# Altium schematic sheet circuit.SchDoc
size A4; SheetNumber: 1; SheetTotal: 2
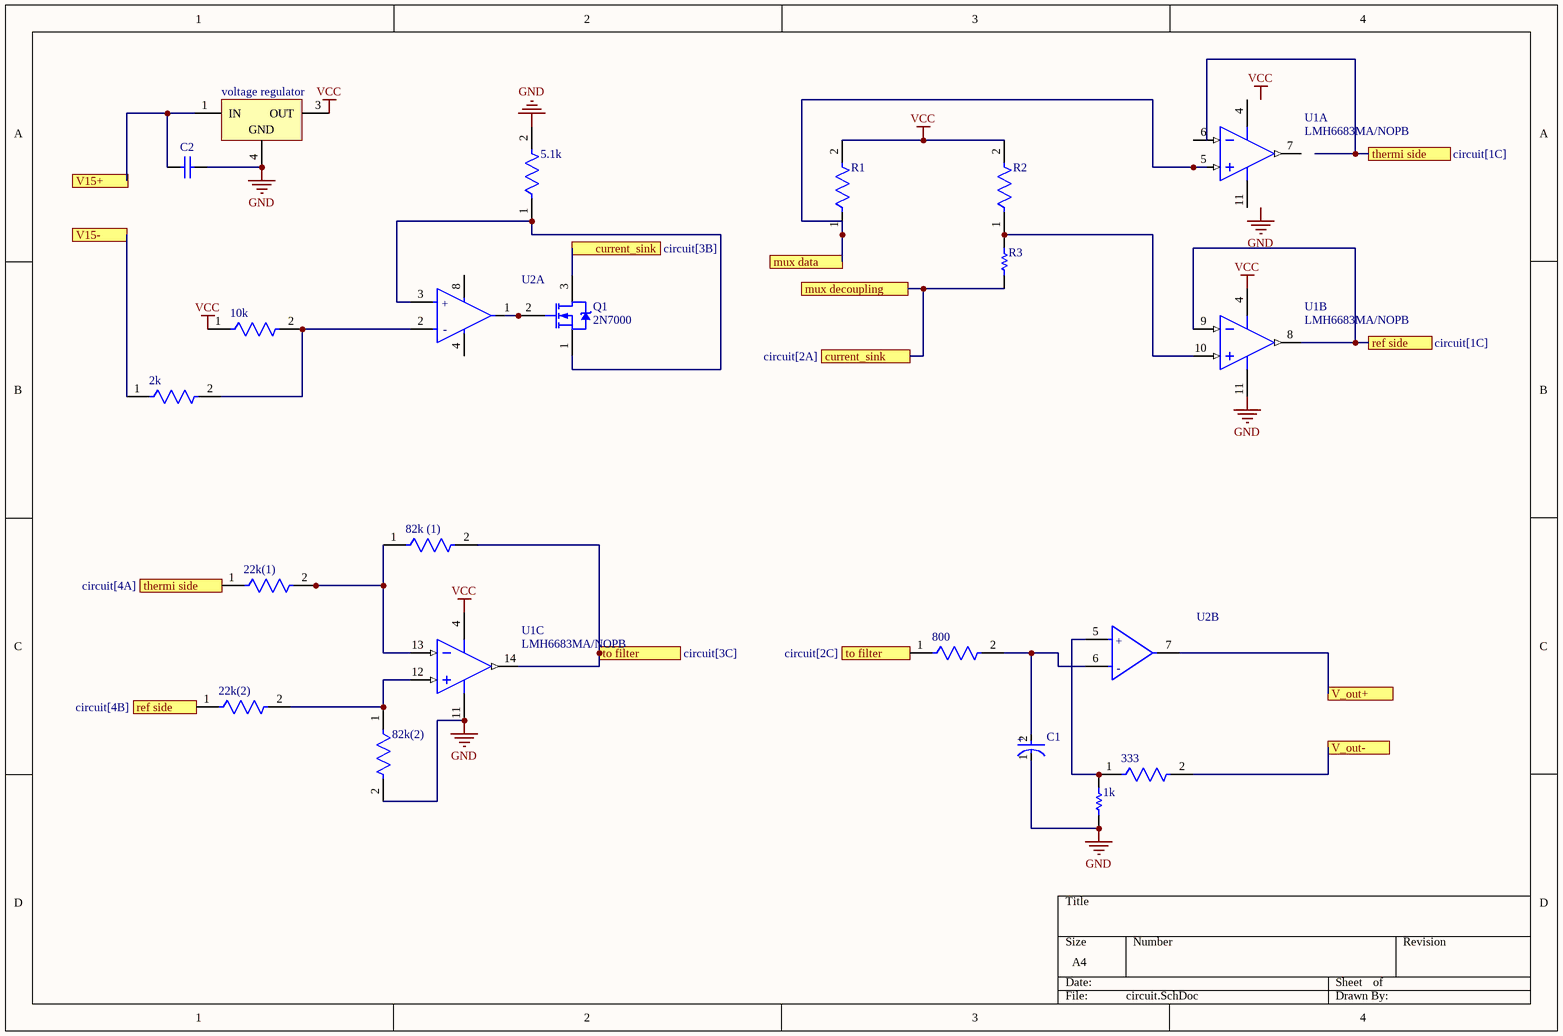
[diagram p0: circuit.SchDoc]

## Parts
1k  CRCW12101K00FKEAHP  [RESC3225X60X45NL20T20]  (value not drawn)
2k  CRCW12062K00FKEA  [FP-CRCW1206-e3-IPC_A]  (value not drawn)
5.1k  CRCW12065K10FKEA  [FP-CRCW1206-e3-IPC_C]  (value not drawn)
10k  CRCW120610K0FKEA  [FP-CRCW1206-e3-IPC_C]  (value not drawn)
22k(1)  CRCW120622K0FKEA  [FP-CRCW1206-e3-IPC_A]  (value not drawn)
22k(2)  CRCW120622K0FKEA  [FP-CRCW1206-e3-IPC_A]  (value not drawn)
82k(2)  CRCW120682K0FKEA  [FP-CRCW1206-e3-IPC_B]  (value not drawn)
82k_(1)  CRCW120682K0FKEA  [FP-CRCW1206-e3-IPC_B]  (value not drawn)
333  CRCW0603330RFKEAHP  [FP-CRCW0603-HPe3-IPC_C]  (value not drawn)
800  MCA12060D8000BP500  [FP-MCA1206-IPC_C]  (value not drawn)
C1  TAJA106K016RNJ  [FP-TAJA-MFG]  (value not drawn)
C2  GRM188R61E105KA12D  [CAPC1608X90X35LL10T15]  (value not drawn)
Q1  2N7000  [ONSC-TO-92-3-29-11]
R1  CRCW120633K0FKEA  [FP-CRCW1206-e3-IPC_B]  (value not drawn)
R2  CRCW120633K0FKEA  [FP-CRCW1206-e3-IPC_B]  (value not drawn)
R3  CRCW120615K0FKEA  [RESC3216X60X45LL10T20]  (value not drawn)
U1  LMH6683MA/NOPB  [D0014A_M]  (parts A,B,C of 4)
U2  LM2904DGKR  [FP-DGK0008A-IPC_B]  (value not drawn)  (parts A,B of 2)
voltage_regulator  L7812CD2T-TR  [TO-263_M]  (value not drawn)

## Ports
current_sink (see circuit[2A]), current_sink (see circuit[3B]), mux data, mux decoupling, ref side (see circuit[1C]), ref side (see circuit[4B]), thermi side (see circuit[1C]), thermi side (see circuit[4A]), to filter (see circuit[2C]), to filter (see circuit[3C]), V15+, V15-, V_out+, V_out-

## Nets
GND: 1k.1 5.1k.2 82k(2).2 C1.1(C) C2.2 U1.11(V-) voltage_regulator.4(GND)
VCC: 10k.1 R1.2 R2.2 U1.4(V+) voltage_regulator.3(OUT)
current_sink: Q1.3(D) R3.1 ; port current_sink, port mux decoupling
mux data: R1.1 U1.5(IN1+) ; port mux data
ref side: 22k(2).1 U1.8(OUT2) U1.9(IN2-) ; port ref side
thermi side: 22k(1).1 ; port thermi side
to filter: 82k_(1).2 800.1 U1.14(OUT3) ; port to filter
V15-: 2k.1 ; port V15-
V_out+: U2.7(OUT2) ; port V_out+
V_out-: 333.2 ; port V_out-
Net1k_2: 1k.2 333.1 U2.5(IN2+)
Net2k_2: 2k.2 10k.2 U2.2(IN1-)
Net5.1k_1: 5.1k.1 Q1.1(S) U2.3(IN1+)
Net22k(1)_2: 22k(1).2 82k_(1).1 U1.13(IN3-)
Net22k(2)_2: 22k(2).2 82k(2).1 U1.12(IN3+)
Net800_2: 800.2 C1.2(A) U2.6(IN2-)
NetC2_1: C2.1 voltage_regulator.1(IN)
NetQ1_2: Q1.2(G) U2.1(OUT1)
NetR2_1: R2.1 R3.2 U1.10(IN2+)

Not connected (* = marked no-connect by the designer): U1 6(IN1-) 7(OUT1); U2 4(V-) 8(V+)

## Notes on the sheet
- Labels drawn without touching a wire or pin: GND, VCC
- (in symbol CMP-1661-00004-2) +
- (in symbol CMP-04895-000305-1, part A) +; -
- (in symbol CMP-04895-000305-1, part B) +; -

## Library data of the parts
1k = CMP-2005-00195-1: Manufacturer: Vishay Dale; Part Number: CRCW12101K00FKEAHP
2k = CMP-1014-00542-3: RES Thick Film, 2kΩ, 1%, 0.25W, 100ppm/°C, 1206; Max Power Dissipation: 250mW; Voltage Rating: 200V; Resistance: 2kR; Package Quantity: 10; Height: 0.55mm; Tolerance: 1%; Number of Terminations: 2; Mount: Surface Mount; Width: 1.6mm; Length: 3.2mm; Features: Automotive AEC-Q200; Contact Plating: Tin; Number of Pins: 2; Weight: 0.000353oz; Max Operating Temperature: 155°C; Min Operating Temperature: -55°C; Termination: SMD/SMT; Temperature Coefficient: 100ppm/°C; Case Code (Imperial): 1206; Depth: 1.6mm; Military Standard: Not; Case Code (Metric): 3216; Composition: Thick Film; Power Rating: 250mW; Case/Package: 1206; Radiation Hardening: No; Packaging: Tape and Reel
5.1k = CMP-1014-00590-3: RES Thick Film, 5.1kΩ, 1%, 0.25W, 100ppm/°C, 1206; Voltage Rating (DC): 200V; Max Power Dissipation: 250mW; Resistance: 5.1kR; Features: Automotive AEC-Q200; Weight: 0.000353oz; Case Code (Imperial): 1206; Case/Package: 1206; Min Operating Temperature: -55°C; Max Operating Temperature: 155°C; Height: 0.55mm; Termination: SMD/SMT; Case Code (Metric): 3216; Power Rating: 250mW; Lead Free: Lead Free; Contact Plating: Tin; Tolerance: 1%; Depth: 1.6mm; Composition: Thick Film; Radiation Hardening: No; Military Standard: Not; Packaging: Tape and Reel; Width: 1.6mm; Voltage Rating: 200V; Package Quantity: 10; Temperature Coefficient: 100ppm/°C; Length: 3.2mm; Number of Terminations: 2
10k = CMP-2003-04807-2: RES Thick Film, 10kΩ, 1%, 0.25W, 100ppm/°C, 1206; Working Voltage: 200V; Max Power Dissipation: 250mW; Resistance: 10kR; Tolerance: 1%; Width: 0.063inch; Height: 0.55mm; Number of Pins: 2; Voltage Rating: 200V; Temperature Coefficient: 100ppm/°C; Military Standard: Not; Features: Automotive AEC-Q200; Depth: 1.6mm; Radiation Hardening: No; Termination: SMD/SMT; Case Code (Imperial): 1206; Weight: 0.000353oz; Length: 3.2mm; Package Quantity: 10; Voltage Rating (DC): 200V; Case/Package: 1206; Min Operating Temperature: -55°C; Number of Terminations: 2; Composition: Thick Film; Contact Plating: Tin; Power Rating: 250mW; Packaging: Tape and Reel; Max Operating Temperature: 155°C; Lead Free: Lead Free; Case Code (Metric): 3216
22k(1) 22k(2) = CMP-2003-01962-2: RES Thick Film, 22kΩ, 1%, 0.25W, 100ppm/°C, 1206; Voltage Rating (DC): 200V; Resistance: 22kR; Max Power Dissipation: 250mW; Lead Free: Lead Free; Length: 3.2mm; Case Code (Imperial): 1206; Max Operating Temperature: 155°C; Packaging: Tape and Reel; Composition: Thick Film; Temperature Coefficient: 100ppm/°C; Contact Plating: Tin; Number of Terminations: 2; Case Code (Metric): 3216; Tolerance: 1%; Weight: 0.000353oz; Features: Automotive AEC-Q200; Min Operating Temperature: -55°C; Width: 0.063inch; Package Quantity: 10; Case/Package: 1206; Termination: SMD/SMT; Military Standard: Not; Depth: 1.6mm; Voltage Rating: 200V; Radiation Hardening: No; Power Rating: 250mW; Height: 0.55mm
82k(2) 82k_(1) = CMP-2003-02402-2: RES Thick Film, 82kΩ, 1%, 0.25W, 100ppm/°C, 1206; Max Power Dissipation: 250mW; Working Voltage: 200V; Resistance: 82kR; Temperature Coefficient: 100ppm/°C; Max Operating Temperature: 155°C; Depth: 1.6mm; Military Standard: Not; Case/Package: 1206; Number of Terminations: 2; Number of Pins: 2; Power Rating: 250mW; Packaging: Tape and Reel; Package Quantity: 10; Width: 0.063inch; Case Code (Imperial): 1206; Height: 0.55mm; Min Operating Temperature: -55°C; Termination: SMD/SMT; Tolerance: 1%; Voltage Rating (DC): 200V; Weight: 0.000353oz; Composition: Thick Film; Case Code (Metric): 3216; Contact Plating: Tin; Radiation Hardening: No; Lead Free: Lead Free; Voltage Rating: 200V; Features: Automotive AEC-Q200; Length: 3.2mm
333 = CMP-02407-011024-1: RES Thick Film, 330Ω, 1%, 0.33W, 100ppm/°C, 0603; Voltage Rating (DC): 75V; Resistance: 330R; Max Power Dissipation: 250mW; Length: 1.6mm; Case/Package: 0603; Depth: 0.85mm; Contact Plating: Tin; Resistor Type: Thick Film; Number of Terminations: 2; Height: 0.45mm; Radiation Hardening: No; Case Code (Imperial): 0603; Width: 0.033inch; Packaging: Tape and Reel; Weight: 7.1E-05oz; Lead Free: Lead Free; Technology: THICK FILM; Features: Automotive AEC-Q200; Resistance Tolerance: 1%; Tolerance: 1%; Termination: SMD/SMT; Max Operating Temperature: 155°C; RoHS Compliant: Yes; Mount: Surface Mount; Power Rating: 250mW; Series: CRCW-HP; Military Standard: Not; Voltage Rating: 75V; Package Quantity: 1; Temperature Coefficient: 100ppm/°C; Construction: Rectangular; Case Code (Metric): 1608; Min Operating Temperature: -55°C
800 = CMP-02407-008722-1: Res MC Precision Thin Film 1206 800Ω 0.1% 0.25W ±25ppm/°C Molded Paper T/R; Resistance: 800R; Max Power Dissipation: 250mW; Lead Free: Lead Free; Package Quantity: 5000; Composition: Thin Film; Tolerance: 0.1%; Number of Terminations: 2; Length: 0.126inch; Width: 0.063inch; Max Operating Temperature: 125°C; Packaging: Tape and Reel; Min Operating Temperature: -55°C; Case/Package: 1206; Temperature Coefficient: 25ppm/°C; Height: 0.026inch
C1 = CMP-1661-00004-2: 10uF 16V  ±10% 3Ω 1206  SMD Tantalum Capacitor; ESR (Equivalent Series Resistance): 3R; Leakage Current: 1.6uA; Dissipation Factor: 8%; Polarity: Polar; Length: 3.2mm; Features: General Purpose; Voltage Rating: 16V; Voltage: 16V; Mount: Surface Mount; Case/Package: 1206; Number of Pins: 2; Case Code (Metric): 3216; Radiation Hardening: No; Min Operating Temperature: -55°C; Case Code (Imperial): 1206; Height - Seated (Max): 0.071inch; Lead Free: Lead Free; Termination: SMD/SMT; Dielectric Material: Tantalum; Width: 1.6mm; Tolerance: 10%; Capacitance: 10uF; Lead Pitch: 1.1mm; Max Operating Temperature: 125°C; Voltage Rating (DC): 16V; Packaging: Tape and Reel; Package Quantity: 1; REACH SVHC: No SVHC; Depth: 1.6mm; Height: 1.6mm
C2 = CMP-2006-02459-1: Manufacturer: Murata; Part Number: GRM188R61E105KA12D
Q1 = CMP-1058-00936-1: Small Signal MOSFET, 200 mA, 60 V, N-Channel, 3-Pin TO-92, Bulk Box; Manufacturer: On Semiconductor; Ciss Typ (pF): 60; VGS(th) Max (V): 3; Crss Typ (pF): 5; Channel Polarity: N Channel; VGS Max (V): 20; Configuration: Single; PD Max (W): 0.35; Coss Typ (pF): 25; ID Max (A): 0.2; PackageVersion: Rev. AM; ComponentLink3URL: http://www.onsemi.cn/pub_link/Collateral/2N6426-D.PDF; ComponentLink2URL: http://www.onsemi.com/pub_link/Collateral/2N7000-D.PDF; DatasheetVersion: Rev. 8; Mounting Technology: Through Hole; V(BR)DSS Min (V): 60; PartNumber: 2N7000; PackageDescription: 3-Pin Transistor Outline, Body 4.825 x 3.685 mm, Pitch 1.27 mm; ComponentLink2Description: Datasheet; ComponentLink1URL: http://www.onsemi.com/; PackageReference: TO-92-3-29-11_AM_SL; Packing: Bulk Box; ComponentLink1Description: Manufacturer URL; Package Type: TO-92; ComponentLink3Description: Package Specification
R1 R2 = CMP-2003-02103-2: RES Thick Film, 33kΩ, 1%, 0.25W, 100ppm/°C, 1206; Working Voltage: 200V; Resistance: 33kR; Power Rating: 250mW; Package Quantity: 10; Max Operating Temperature: 155°C; Height: 0.55mm; Length: 3.2mm; Lead Free: Lead Free; Contact Plating: Tin; Min Operating Temperature: -55°C; Voltage Rating (DC): 200V; Case Code (Metric): 3216; Depth: 1.6mm; Voltage Rating: 200V; Tolerance: 1%; Weight: 0.000353oz; Termination: SMD/SMT; Composition: Thick Film; Military Standard: Not; Features: Automotive AEC-Q200; Case Code (Imperial): 1206; Case/Package: 1206; Number of Terminations: 2; Packaging: Tape and Reel; Temperature Coefficient: 100ppm/°C; Width: 1.6mm; Max Power Dissipation: 250mW; Radiation Hardening: No
R3 = CMP-2003-01817-1: Manufacturer: Vishay Dale; Part Number: CRCW120615K0FKEA
U1 = CMP-0055-00500-3: 190MHz Single Supply, Dual and Triple Operational Amplifiers, 14-pin Narrow SOIC, Pb-Free; Manufacturer: Texas Instruments; PowerWise: N; PackageTopMarking: NSUZXYTTE#*LMH66*83MA; ComponentLink1Description: Datasheet URL; Package Reference: D0014A; PackageDescription: Molded Package S.O., .150in Wide, 14 Lead; CompType: Amplifiers; Code_JEDEC: MS-012AB; RoHS: Y; Code_IPC: SOIC127P600-14; ComponentLink1URL: http://www.ti.com/general/docs/lit/getliterature.tsp?genericPartNumber=LMH6683&fileType=pdf; PinCount: 14
U2 = CMP-04895-000305-1: IC OPAMP GP 2 CIRCUIT 8VSSOP; Min Dual Supply Voltage: 1.5V; Output Current: 30mA; Gain Bandwidth Product: 700kHz; Operating Supply Current: 1mA; Common Mode Rejection Ratio: 50dB; Number of Elements: 2; Dual Supply Voltage: 9V; Slew Rate: 0.3V/µs; Voltage Gain: 100dB; Min Supply Voltage: 3V; Input Offset Voltage (Vos): 7mV; Max Supply Voltage: 26V; Nominal Supply Current: 1.2mA; Operating Supply Voltage: 13V; Input Bias Current: 250nA; Max Operating Temperature: 125°C; Number of Pins: 8; Length: 3mm; RoHS Compliant: Yes; Power Supply Rejection Ratio (PSRR): 50dB; Unity Gain Bandwidth Product: 700kHz; Package Quantity: 1; Case/Package: MSOP; REACH SVHC: No SVHC; Lead Free: Lead Free; Bandwidth: 700kHz; Number of Amplifiers: 2; Width: 3mm; Height: 0.97mm; Radiation Hardening: No; Packaging: Tape and Reel; Number of Circuits: 2; Min Operating Temperature: -40°C; Number of Channels: 2; Max Dual Supply Voltage: 13V; Mount: Surface Mount; Contact Plating: Gold; Output Current per Channel: 30mA
voltage_regulator = CMP-0244-00182-1: Positive Voltage Regulator, 3-Pin D2PAK, Tape and Reel; PackageDescription: 3-Pin Transistor Outline Package 2.54 mm Pitch, 15.4 mm Lead Span (D2PAK); ComponentLink1Description: Manufacturer URL; PackageReference: TO-263; DatasheetVersion: 16/11/2011; ComponentLink2URL: http://www.st.com/internet/com/TECHNICAL_RESOURCES/TECHNICAL_LITERATURE/DATASHEET/CD00000444.pdf; ComponentLink1URL: http://www.st.com; PackageVersion: 2011; ComponentLink2Description: Datasheet